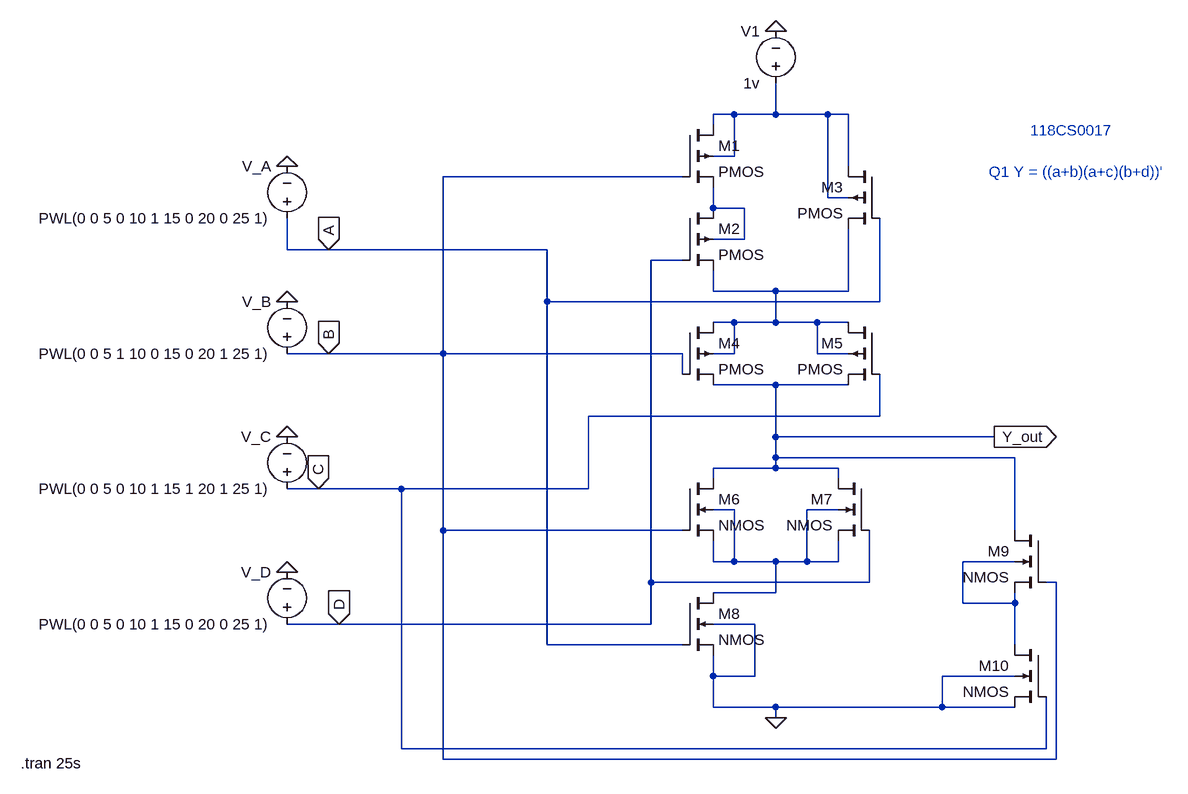
[diagram p0: schematic Draft15.asc]
Draft15.asc, the LTspice schematic file:
Version 4
SHEET 1 884 1032
WIRE 176 16 144 16
WIRE 240 16 240 -32
WIRE 240 16 176 16
WIRE 320 16 240 16
WIRE 352 16 320 16
WIRE 144 32 144 16
WIRE 176 80 176 16
WIRE 176 80 144 80
WIRE 352 96 352 16
WIRE 96 112 -272 112
WIRE 320 144 320 16
WIRE 352 144 320 144
WIRE 144 160 144 128
WIRE 192 160 144 160
WIRE 192 208 192 160
WIRE 192 208 144 208
WIRE -512 224 -512 176
WIRE -448 224 -512 224
WIRE -112 224 -448 224
WIRE 96 240 48 240
WIRE 144 288 144 256
WIRE 240 288 144 288
WIRE 352 288 352 192
WIRE 352 288 240 288
WIRE -112 304 -112 224
WIRE 400 304 400 176
WIRE 400 304 -112 304
WIRE 176 336 144 336
WIRE 240 336 240 288
WIRE 240 336 176 336
WIRE 304 336 240 336
WIRE 352 336 304 336
WIRE -448 384 -512 384
WIRE -272 384 -272 112
WIRE -272 384 -448 384
WIRE 96 384 -272 384
WIRE 176 384 176 336
WIRE 176 384 144 384
WIRE 304 384 304 336
WIRE 352 384 304 384
WIRE 96 416 96 384
WIRE 240 432 144 432
WIRE 352 432 240 432
WIRE 400 480 400 416
WIRE 400 480 -48 480
WIRE 240 512 240 432
WIRE 576 512 240 512
WIRE 240 544 240 512
WIRE 608 544 240 544
WIRE 240 560 240 544
WIRE 240 560 144 560
WIRE 336 560 240 560
WIRE 144 576 144 560
WIRE 336 576 336 560
WIRE -464 592 -512 592
WIRE -336 592 -464 592
WIRE -48 592 -48 480
WIRE -48 592 -336 592
WIRE 176 624 144 624
WIRE 336 624 288 624
WIRE -272 656 -272 384
WIRE 96 656 -272 656
WIRE 608 656 608 544
WIRE 144 704 144 672
WIRE 176 704 176 624
WIRE 176 704 144 704
WIRE 240 704 176 704
WIRE 288 704 288 624
WIRE 288 704 240 704
WIRE 336 704 336 672
WIRE 336 704 288 704
WIRE 608 704 528 704
WIRE 48 736 48 240
WIRE 384 736 384 656
WIRE 384 736 48 736
WIRE 672 736 656 736
WIRE 240 752 240 704
WIRE 240 752 144 752
WIRE 528 768 528 704
WIRE 608 768 608 752
WIRE 608 768 528 768
WIRE -432 800 -512 800
WIRE 48 800 48 736
WIRE 48 800 -432 800
WIRE 208 800 144 800
WIRE -112 832 -112 304
WIRE 96 832 -112 832
WIRE 608 832 608 768
WIRE 144 880 144 848
WIRE 208 880 208 800
WIRE 208 880 144 880
WIRE 608 880 496 880
WIRE 144 928 144 880
WIRE 240 928 144 928
WIRE 496 928 496 880
WIRE 496 928 240 928
WIRE 608 928 496 928
WIRE 240 944 240 928
WIRE -336 992 -336 592
WIRE 656 992 656 912
WIRE 656 992 -336 992
WIRE -272 1008 -272 656
WIRE 672 1008 672 736
WIRE 672 1008 -272 1008
FLAG 240 -112 0
FLAG 240 944 0
FLAG -512 96 0
FLAG -512 304 0
FLAG -512 512 0
FLAG -512 720 0
FLAG 576 512 Y_out
IOPIN 576 512 Out
FLAG -448 224 A
IOPIN -448 224 In
FLAG -448 384 B
IOPIN -448 384 In
FLAG -464 592 C
IOPIN -464 592 In
FLAG -432 800 D
IOPIN -432 800 In
SYMBOL pmos4 96 32 R0
SYMATTR InstName M1
SYMBOL pmos4 96 160 R0
SYMATTR InstName M2
SYMBOL pmos4 400 96 M0
SYMATTR InstName M3
SYMBOL pmos4 96 336 R0
SYMATTR InstName M4
SYMBOL pmos4 400 336 M0
SYMATTR InstName M5
SYMBOL voltage 240 -16 R180
WINDOW 0 24 96 Left 2
WINDOW 3 24 16 Left 2
SYMATTR InstName V1
SYMATTR Value 1v
SYMBOL nmos4 96 576 R0
SYMATTR InstName M6
SYMBOL nmos4 384 576 M0
SYMATTR InstName M7
SYMBOL nmos4 96 752 R0
SYMATTR InstName M8
SYMBOL nmos4 656 656 M0
SYMATTR InstName M9
SYMBOL nmos4 656 832 M0
SYMATTR InstName M10
SYMBOL voltage -512 816 R180
WINDOW 0 24 96 Left 2
WINDOW 3 24 16 Left 2
WINDOW 123 0 0 Left 0
WINDOW 39 0 0 Left 0
SYMATTR InstName V_D
SYMATTR Value PWL(0 0 5 0 10 1 15 0 20 0 25 1)
SYMBOL voltage -512 608 R180
WINDOW 0 24 96 Left 2
WINDOW 3 24 16 Left 2
WINDOW 123 0 0 Left 0
WINDOW 39 0 0 Left 0
SYMATTR InstName V_C
SYMATTR Value PWL(0 0 5 0 10 1 15 1 20 1 25 1)
SYMBOL voltage -512 400 R180
WINDOW 0 24 96 Left 2
WINDOW 3 24 16 Left 2
WINDOW 123 0 0 Left 0
WINDOW 39 0 0 Left 0
SYMATTR InstName V_B
SYMATTR Value PWL(0 0 5 1 10 0 15 0 20 1 25 1)
SYMBOL voltage -512 192 R180
WINDOW 0 24 96 Left 2
WINDOW 3 24 16 Left 2
WINDOW 123 0 0 Left 0
WINDOW 39 0 0 Left 0
SYMATTR InstName V_A
SYMATTR Value PWL(0 0 5 0 10 1 15 0 20 0 25 1)
TEXT -922 1014 Left 2 !.tran 25s
TEXT 632 40 Left 2 ;118CS0017
TEXT 568 104 Left 2 ;Q1 Y = ((a+b)(a+c)(b+d))'

The netlist it stands for:
* Draft15.asc
M1 N001 B N002 N001 PMOS
M2 N002 D N003 N002 PMOS
M3 N001 A N003 N001 PMOS
M4 N003 B Y_out N003 PMOS
M5 N003 C Y_out N003 PMOS
V1 N001 0 1v
M6 Y_out B N004 N004 NMOS
M7 Y_out D N004 N004 NMOS
M8 N004 A 0 0 NMOS
M9 Y_out B N005 N005 NMOS
M10 N005 C 0 0 NMOS
V_D D 0 PWL(0 0 5 0 10 1 15 0 20 0 25 1)
V_C C 0 PWL(0 0 5 0 10 1 15 1 20 1 25 1)
V_B B 0 PWL(0 0 5 1 10 0 15 0 20 1 25 1)
V_A A 0 PWL(0 0 5 0 10 1 15 0 20 0 25 1)
.model NMOS NMOS
.model PMOS PMOS
.lib standard.mos
.tran 25s
* 118CS0017
* Q1 Y = ((a+b)(a+c)(b+d))'
.backanno
.end